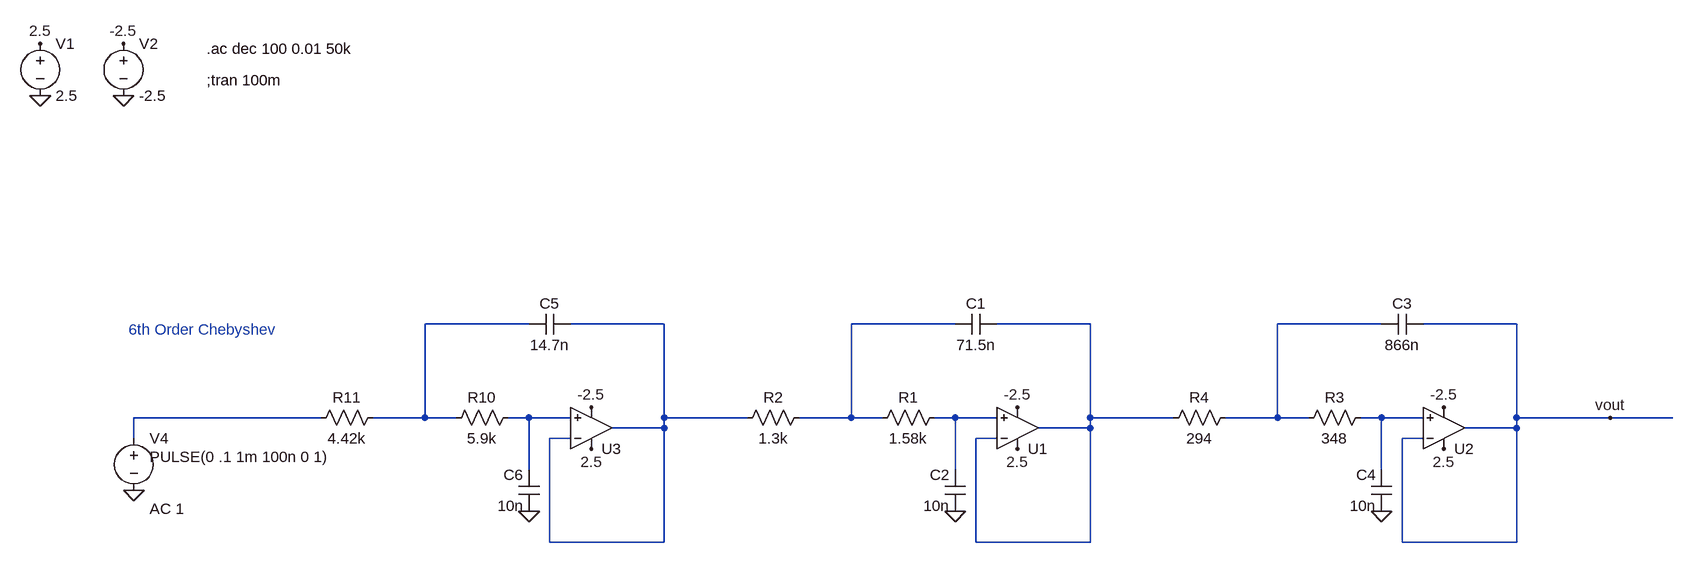
[diagram p0: schematic chebyshev_6th_order_0.1dB.asc]
chebyshev_6th_order_0.1dB.asc, the LTspice schematic file:
Version 4
SHEET 1 2244 1604
WIRE 224 -16 64 -16
WIRE 432 -16 288 -16
WIRE 880 -16 720 -16
WIRE 1088 -16 944 -16
WIRE 1536 -16 1376 -16
WIRE 1744 -16 1600 -16
WIRE -96 128 -384 128
WIRE 64 128 64 -16
WIRE 64 128 -16 128
WIRE 112 128 64 128
WIRE 224 128 192 128
WIRE 288 128 224 128
WIRE 432 128 432 -16
WIRE 560 128 432 128
WIRE 720 128 720 -16
WIRE 720 128 640 128
WIRE 768 128 720 128
WIRE 880 128 848 128
WIRE 944 128 880 128
WIRE 1088 128 1088 -16
WIRE 1216 128 1088 128
WIRE 1376 128 1376 -16
WIRE 1376 128 1296 128
WIRE 1424 128 1376 128
WIRE 1536 128 1504 128
WIRE 1600 128 1536 128
WIRE 1744 128 1744 -16
WIRE 1888 128 1744 128
WIRE 1984 128 1888 128
WIRE 432 144 432 128
WIRE 432 144 352 144
WIRE 1088 144 1088 128
WIRE 1088 144 1008 144
WIRE 1744 144 1744 128
WIRE 1744 144 1664 144
WIRE -384 160 -384 128
WIRE 288 160 256 160
WIRE 944 160 912 160
WIRE 1600 160 1568 160
WIRE 224 208 224 128
WIRE 880 208 880 128
WIRE 1536 208 1536 128
WIRE 256 320 256 160
WIRE 432 320 432 144
WIRE 432 320 256 320
WIRE 912 320 912 160
WIRE 1088 320 1088 144
WIRE 1088 320 912 320
WIRE 1568 320 1568 160
WIRE 1744 320 1744 144
WIRE 1744 320 1568 320
FLAG -528 -448 2.5
FLAG -400 -448 -2.5
FLAG -528 -368 0
FLAG -400 -368 0
FLAG 320 176 2.5
FLAG 320 112 -2.5
FLAG 224 272 0
FLAG -384 240 0
FLAG 976 176 2.5
FLAG 976 112 -2.5
FLAG 880 272 0
FLAG 1632 176 2.5
FLAG 1632 112 -2.5
FLAG 1536 272 0
FLAG 1888 128 vout
SYMBOL voltage -528 -464 R0
WINDOW 123 0 0 Left 0
WINDOW 39 0 0 Left 0
SYMATTR InstName V1
SYMATTR Value 2.5
SYMBOL voltage -400 -464 R0
WINDOW 123 0 0 Left 0
WINDOW 39 0 0 Left 0
SYMATTR InstName V2
SYMATTR Value -2.5
SYMBOL Opamps\\UniversalOpamp2 320 144 M180
SYMATTR InstName U3
SYMBOL res 208 112 R90
WINDOW 0 0 56 VBottom 2
WINDOW 3 32 56 VTop 2
SYMATTR InstName R10
SYMATTR Value 5.9k
SYMBOL res 0 112 R90
WINDOW 0 0 56 VBottom 2
WINDOW 3 32 56 VTop 2
SYMATTR InstName R11
SYMATTR Value 4.42k
SYMBOL cap 288 -32 R90
WINDOW 0 0 32 VBottom 2
WINDOW 3 32 32 VTop 2
SYMATTR InstName C5
SYMATTR Value 14.7n
SYMBOL cap 240 272 R180
WINDOW 0 24 56 Left 2
WINDOW 3 24 8 Left 2
SYMATTR InstName C6
SYMATTR Value 10n
SYMBOL voltage -384 144 R0
WINDOW 123 24 124 Left 2
WINDOW 39 0 0 Left 0
WINDOW 3 24 44 Left 2
SYMATTR Value2 AC 1
SYMATTR Value PULSE(0 .1 1m 100n 0 1)
SYMATTR InstName V4
SYMBOL Opamps\\UniversalOpamp2 976 144 M180
SYMATTR InstName U1
SYMBOL res 864 112 R90
WINDOW 0 0 56 VBottom 2
WINDOW 3 32 56 VTop 2
SYMATTR InstName R1
SYMATTR Value 1.58k
SYMBOL res 656 112 R90
WINDOW 0 0 56 VBottom 2
WINDOW 3 32 56 VTop 2
SYMATTR InstName R2
SYMATTR Value 1.3k
SYMBOL cap 944 -32 R90
WINDOW 0 0 32 VBottom 2
WINDOW 3 32 32 VTop 2
SYMATTR InstName C1
SYMATTR Value 71.5n
SYMBOL cap 896 272 R180
WINDOW 0 24 56 Left 2
WINDOW 3 24 8 Left 2
SYMATTR InstName C2
SYMATTR Value 10n
SYMBOL Opamps\\UniversalOpamp2 1632 144 M180
SYMATTR InstName U2
SYMBOL res 1520 112 R90
WINDOW 0 0 56 VBottom 2
WINDOW 3 32 56 VTop 2
SYMATTR InstName R3
SYMATTR Value 348
SYMBOL res 1312 112 R90
WINDOW 0 0 56 VBottom 2
WINDOW 3 32 56 VTop 2
SYMATTR InstName R4
SYMATTR Value 294
SYMBOL cap 1600 -32 R90
WINDOW 0 0 32 VBottom 2
WINDOW 3 32 32 VTop 2
SYMATTR InstName C3
SYMATTR Value 866n
SYMBOL cap 1552 272 R180
WINDOW 0 24 56 Left 2
WINDOW 3 24 8 Left 2
SYMATTR InstName C4
SYMATTR Value 10n
TEXT -272 -440 Left 2 !.ac dec 100 0.01 50k
TEXT -272 -392 Left 2 !;tran 100m
TEXT -392 -8 Left 2 ;6th Order Chebyshev

The netlist it stands for:
* chebyshev_6th_order_0.1dB.asc
V1 2.5 0 2.5
V2 -2.5 0 -2.5
XU3 N007 N002 2.5 -2.5 N002 level.2 Avol=1Meg GBW=10Meg Slew=10Meg ilimit=25m rail=0 Vos=0 phimargin=45 en=0 enk=0 in=0 ink=0 Rin=500Meg  ; pins IN+ IN- V+ V- OUT
R10 N007 N001 5.9k
R11 N001 N006 4.42k
C5 N002 N001 14.7n
C6 0 N007 10n
V4 N006 0 PULSE(0 .1 1m 100n 0 1) AC 1
XU1 N008 N004 2.5 -2.5 N004 level.2 Avol=1Meg GBW=10Meg Slew=10Meg ilimit=25m rail=0 Vos=0 phimargin=45 en=0 enk=0 in=0 ink=0 Rin=500Meg  ; pins IN+ IN- V+ V- OUT
R1 N008 N003 1.58k
R2 N003 N002 1.3k
C1 N004 N003 71.5n
C2 0 N008 10n
XU2 N009 vout 2.5 -2.5 vout level.2 Avol=1Meg GBW=10Meg Slew=10Meg ilimit=25m rail=0 Vos=0 phimargin=45 en=0 enk=0 in=0 ink=0 Rin=500Meg  ; pins IN+ IN- V+ V- OUT
R3 N009 N005 348
R4 N005 N004 294
C3 vout N005 866n
C4 0 N009 10n
.ac dec 100 0.01 50k
;tran 100m
* 6th Order Chebyshev
.lib UniversalOpamps2.sub
.backanno
.end